# EAGLE schematic Schaltplan (EAGLE 7.7.0)
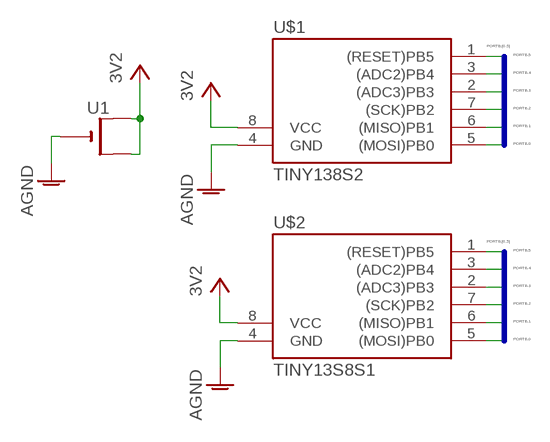
[diagram p0: schematic, sheet 1]

## Parts
U1  CR2032SMT  [CR2032-SMD]
U$1  TINY138S2  [SO08]
U$2  TINY13S8S1  [SO08-GW]

## Nets
AGND: U1.- U$1.4(GND) U$2.4(GND)
PORTB.0: U$1.5((MOSI)PB0) U$2.5((MOSI)PB0)
PORTB.1: U$1.6((MISO)PB1) U$2.6((MISO)PB1)
PORTB.2: U$1.7((SCK)PB2) U$2.7((SCK)PB2)
PORTB.3: U$1.2((ADC3)PB3) U$2.2((ADC3)PB3)
PORTB.4: U$1.3((ADC2)PB4) U$2.3((ADC2)PB4)
PORTB.5: U$1.1((RESET)PB5) U$2.1((RESET)PB5)
VCC: U1.+$1(+) U1.+$2(+1) U$1.8(VCC) U$2.8(VCC) ; supply symbol labelled 3V2

## Buses
PORTB.[0..5]

## Library data of the parts
U1 = cr2032:CR2032
U$1 U$2 = Atmel - µController:TINY13*